# Altium project TrackBalloptics.PrjPcb
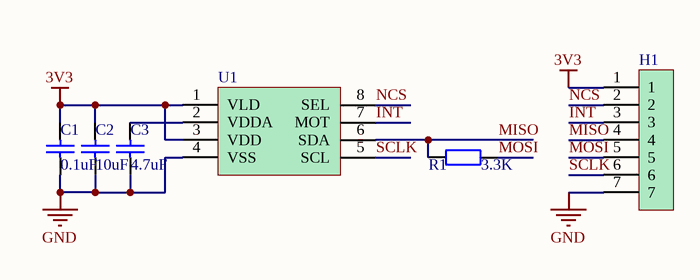
[diagram p0: TrackBalloptics.SchDoc]
1 sheet, 6 parts. Net scope: global (net labels, ports and power ports of the same name join across sheets).
Board file: TrackBalloptics.PcbDoc

## Sheet TrackBalloptics.SchDoc
size A4; SheetNumber: 1; SheetTotal: 1

### Parts
C1  0.1uF  [0603]
C2  10uF  [0603]
C3  4.7uF  [0603]
H1  SH1.25mm_7P  [SH1.25MM_7P]  (value not drawn)
R1  3.3K  [R_0603]
U1  Optical Tracking Miniature Chip  [PAT9125EL]  (value not drawn)

### Nets
3V3: C1.2 C2.2 H1.1 U1.1(VLD) U1.3(VDD)
GND: C1.1 C2.1 C3.1 H1.7 U1.4(VSS)
INT: H1.3 U1.7(MOT)
MISO: H1.4 R1.1 U1.6(SDA)
MOSI: H1.5 R1.2
NCS: H1.2 U1.8(SEL)
SCLK: H1.6 U1.5(SCL)
NetC3_2: C3.2 U1.2(VDDA)

### Library data of the parts
C1-C3 = CAP_0603: 贴片电容 0603
R1 = RES_0603: 电阻 0603
U1 = PAT9125EL